# EasyEDA Pro project ProPrj_FYP_Flexible_PCB_Final.epro

# Schematic RC_LPF
Board Name: RC_LPF; Create Date: 2026-05-18; Page Name: P1; Project Name: FYP_Final_ExternalProgrammer; Schematic Name: RC_LPF; Update Date: 2026-05-18; Company: EasyEDA.com; Page Size: A4; Version: V1.0
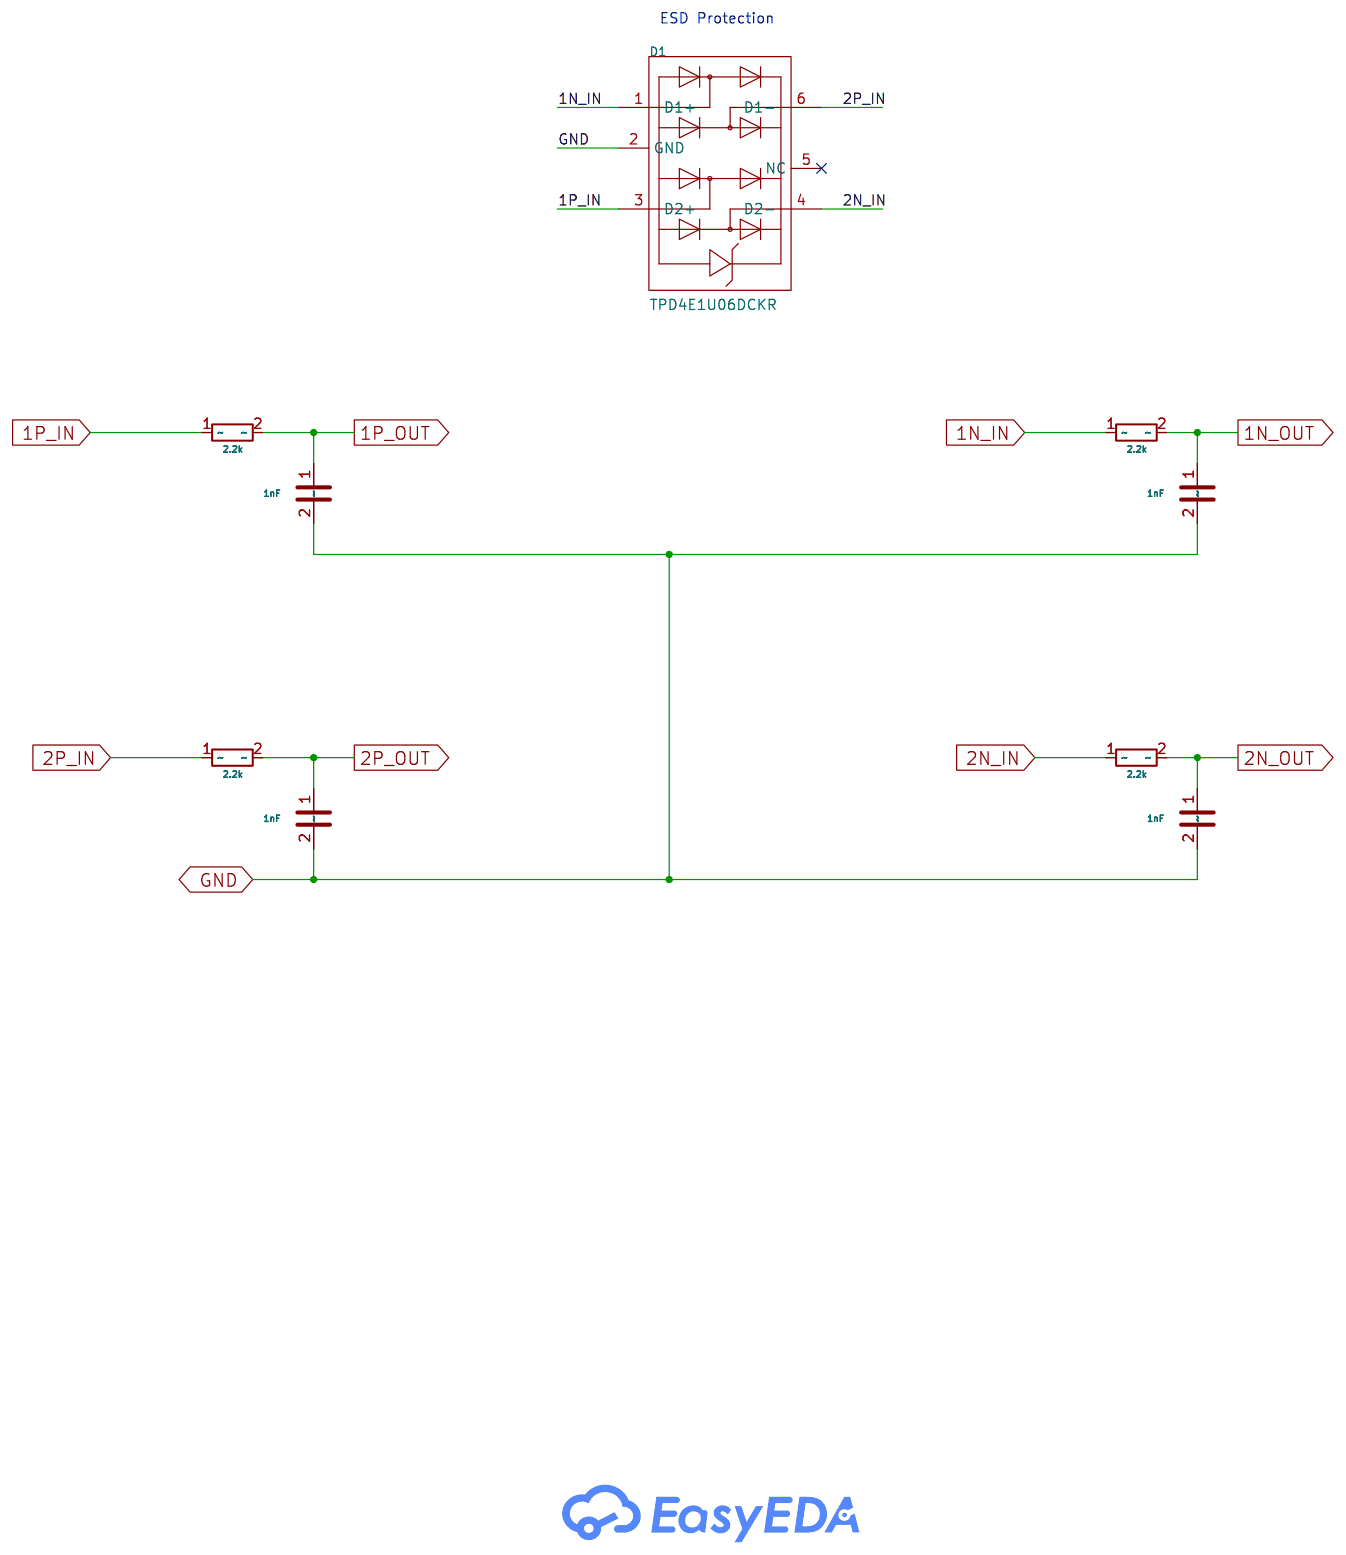
[diagram p0: schematic sheet]

## Parts
C24  1nF  [Capacitor_SMD:C_0805_2012Metric]
C25  1nF  [Capacitor_SMD:C_0805_2012Metric]
C26  1nF  [Capacitor_SMD:C_0805_2012Metric]
C27  1nF  [Capacitor_SMD:C_0805_2012Metric]
D1  TPD4E1U06DCKR  [SC-70-6_L2.2-W1.3-P0.65-LS2.1-BL]
R27  2.2k  [R0402]
R34  2.2k  [R0402]
R35  2.2k  [R0402]
R36  2.2k  [R0402]

## Library data of the parts
C24-C27 = Device_C: Attribute1: C3
D1 = TPD4E1U06DCKR: Polarity:Unidirectional Reverse Stand-Off Voltage (Vrwm):5.5V Clamping Voltage:15V Peak Pulse Current (Ipp):3A@8/20us Peak Pulse Power Dissipation (Ppp):45W@8/20us Voltage - Breakdown:6.5V Reverse Leakage Current (Ir):10nA Number of Channels:4 Operating T; LCSC Part Name: 单向ESD; Supplier Part: C194628; Manufacturer: TI(德州仪器); Supplier Footprint: SOT-363; JLCPCB Part Class: Extended Part; Datasheet: https://www.ti.com/cn/lit/gpn/tpd4e1u06; Supplier: LCSC; Polarity: Unidirectional; Reverse Stand-Off Voltage (Vrwm): 5.5V; Clamping Voltage: 15V; Peak Pulse Current (Ipp): 3A@8/20us; Peak Pulse Power Dissipation (Ppp): 45W@8/20us; Voltage - Breakdown: 6.5V; Reverse Leakage Current (Ir): 10nA; Number of Channels: 4; Operating Temperature: -40℃~+125℃; level of protection: IEC 61000-4-4；IEC 61000-4-5；IEC 61000-4-2; Type: TVS; Junction Capacitance: 0.8pF
R27 R34-R36 = Device_R: Attribute1: R16

## Nets
GND: C24.2 C25.2 C26.2 C27.2 D1.2(GND)
1N_IN: D1.1(D1+) R34.1
1N_OUT: C25.1 R34.2
1P_IN: D1.3(D2+) R27.1
1P_OUT: C24.1 R27.2
2N_IN: D1.4(D2-) R36.1
2N_OUT: C27.1 R36.2
2P_IN: D1.6(D1-) R35.1
2P_OUT: C26.1 R35.2

Not connected (* = marked no-connect by the designer): D1 5(NC)*

## Notes on the sheet
- ESD Protection

# Schematic Schematic1
Board Name: Board1; Create Date: 2026-05-18; Page Name: Main; Project Name: FYP_Final_ExternalProgrammer; Schematic Name: Schematic1; Update Date: 2026-05-19; Company: EasyEDA.com; Page Size: A4; Version: V1.0
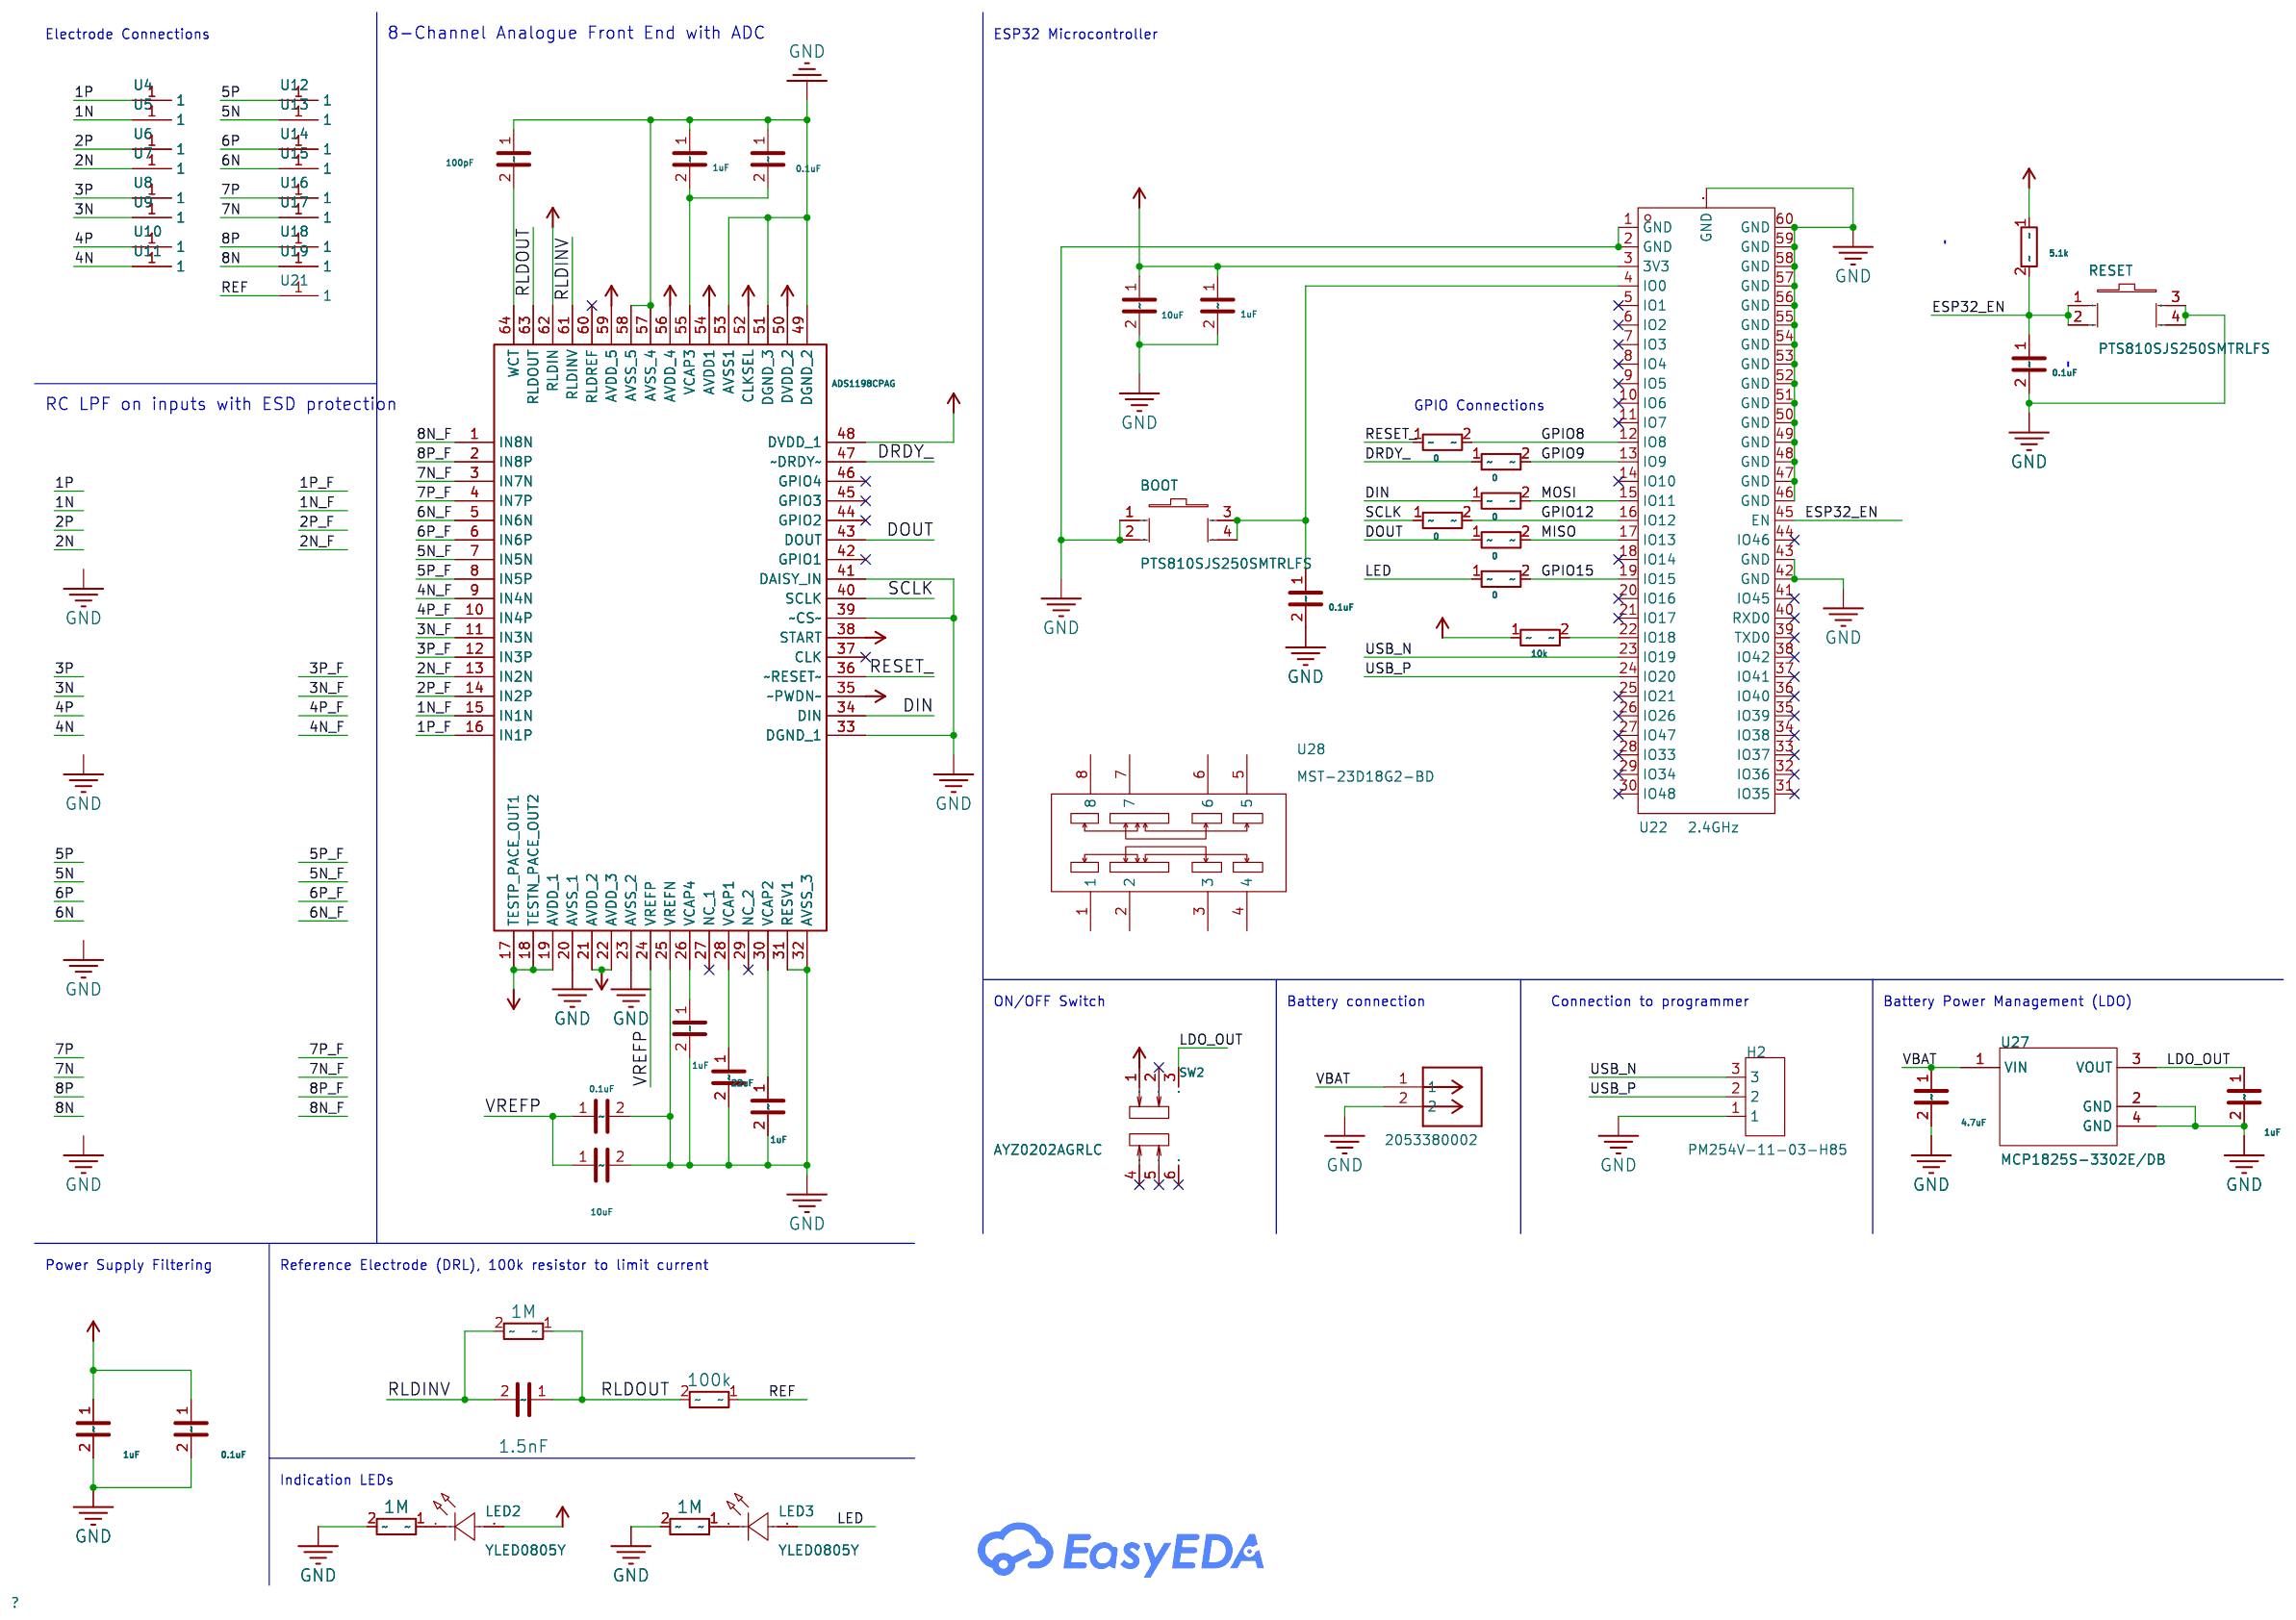
[diagram p1: schematic sheet]

## Parts
BOOT  PTS810SJS250SMTRLFS  [SW-SMD_4P_PTS810SJM250SMTRLFS]
C3  1uF  [Capacitor_SMD:C_0805_2012Metric]
C5  1.5nF  [Capacitor_SMD:C_0805_2012Metric]
C6  100pF  [Capacitor_SMD:C_0805_2012Metric]
C7  0.1uF  [Capacitor_SMD:C_0805_2012Metric]
C8  10uF  [Capacitor_SMD:C_0805_2012Metric]
C9  1uF  [Capacitor_SMD:C_0805_2012Metric]
C10  1uF  [Capacitor_SMD:C_0805_2012Metric]
C11  22uF  [Capacitor_SMD:C_0805_2012Metric]
C12  1uF  [Capacitor_SMD:C_0805_2012Metric]
C18  0.1uF  [Capacitor_SMD:C_0805_2012Metric]
C20  0.1uF  [Capacitor_SMD:C_0805_2012Metric]
C22  0.1uF  [Capacitor_SMD:C_0805_2012Metric]
C23  10uF  [Capacitor_SMD:C_0805_2012Metric]
C28  1uF  [Capacitor_SMD:C_0805_2012Metric]
C29  0.1uF  [Capacitor_SMD:C_0805_2012Metric]
C35  1uF  [Capacitor_SMD:C_0805_2012Metric]
C36  4.7uF  [Capacitor_SMD:C_0805_2012Metric]
CBB1  -
CBB2  -
CBB3  -
CBB4  -
H2  PM254V-11-03-H85  [HDR-TH_3P-P2.54-V-F]
IC2  ADS1198CPAG  [ADS1198CPAG:QFP50P1200X1200X120-64N]
LED2  YLED0805Y  [LED0805-RD_YELLOW]
LED3  YLED0805Y  [LED0805-RD_YELLOW]
R7  1M  [Resistor_SMD:R_0805_2012Metric]
R22  5.1k  [Resistor_SMD:R_0805_2012Metric]
R26  10k  [Resistor_SMD:R_0805_2012Metric]
R27  0  [Resistor_SMD:R_0805_2012Metric]
R29  0  [Resistor_SMD:R_0805_2012Metric]
R30  0  [Resistor_SMD:R_0805_2012Metric]
R31  0  [Resistor_SMD:R_0805_2012Metric]
R32  0  [Resistor_SMD:R_0805_2012Metric]
R33  0  [Resistor_SMD:R_0805_2012Metric]
R37  100k  [Resistor_SMD:R_0805_2012Metric]
R42  1M  [Resistor_SMD:R_0805_2012Metric]
R44  1M  [Resistor_SMD:R_0805_2012Metric]
RESET  PTS810SJS250SMTRLFS  [SW-SMD_4P_PTS810SJM250SMTRLFS]
SW2  AYZ0202AGRLC  [SW-SMD_AYZ0202AGRLC]
U4  -  [Electrode_Contact]  (no BOM)
U5  -  [Electrode_Contact]  (no BOM)
U6  -  [Electrode_Contact]  (no BOM)
U7  -  [Electrode_Contact]  (no BOM)
U8  -  [Electrode_Contact]  (no BOM)
U9  -  [Electrode_Contact]  (no BOM)
U10  -  [Electrode_Contact]  (no BOM)
U11  -  [Electrode_Contact]  (no BOM)
U12  -  [Electrode_Contact]  (no BOM)
U13  -  [Electrode_Contact]  (no BOM)
U14  -  [Electrode_Contact]  (no BOM)
U15  -  [Electrode_Contact]  (no BOM)
U16  -  [Electrode_Contact]  (no BOM)
U17  -  [Electrode_Contact]  (no BOM)
U18  -  [Electrode_Contact]  (no BOM)
U19  -  [Electrode_Contact]  (no BOM)
U20  2053380002  [CONN_2053380000-SD_02_MOL]
U21  -  [Electrode_Contact]  (no BOM)
U22  2.4GHz  [BULETM-SMD_ESP32-S3-MINI-1-N8]
U27  MCP1825S-3302E/DB  [SOT-223-3_L6.5-W3.4-P2.30-LS7.0-BR]
U28  MST-23D18G2-BD  [SW-SMD_SHOU_MST23D18G2]

## Library data of the parts
BOOT RESET = PTS810SJS250SMTRLFS: Circuit:SPST Actuator Style:Round Button Operating Force:6N Mounting Type:Surface Mount,Vertical Length:4.2mm Width:3.2mm Switch Height:2.5mm Contact Current:50mA Voltage Rating:16V With Lamp:- Termination Style:J-Lead Life:- Operating Temperature:-40℃~+8; LCSC Part Name: 轻触开关4.2mm*3.2mm，600gf; Supplier Part: C221897; Manufacturer: C&K; Supplier Footprint: SMD-4P,3.2x4.2mm; JLCPCB Part Class: Extended Part; Datasheet: https://item.szlcsc.com/datasheet/PTS810SJS250SMTRLFS/222327.html; Supplier: LCSC; Circuit: SPST; Actuator Style: Round Button; Operating Force: 6N; Mounting Type: Surface Mount,Vertical; Length: 4.2mm; Width: 3.2mm; Switch Height: 2.5mm; Contact Current: 50mA; Voltage Rating: 16V; Termination Style: J-Lead; Operating Temperature: -40℃~+85℃
C3 = Device_C
C5-C12 C20 C22 C28 C29 C35 C36 = Device_C: Attribute1: C3
C18 C23 = Device_C: Unpolarized capacitor; Attribute1: C3
H2 = PM254V-11-03-H85: Holes Structure:1x3P Pitch:2.54mm Row Spacing:- Circular Hole / Square Hole:Square Hole Mounting Type:Through Hole Number of Rows:1 Number of Positions:3P Current Rating:3A Holes Direction:Top Insulation Height:8.5mm Contact Material:Brass Contact Plating; LCSC Part Name: 1x3P 间距:2.54mm 直插; Supplier Part: C541850; Manufacturer: XFCN(兴飞); Supplier Footprint: 插件,P=2.54mm; JLCPCB Part Class: Extended Part; Datasheet: https://item.szlcsc.com/datasheet/PM254V-11-03-H85/562471.html; Supplier: LCSC; Holes Structure: 1x3P; Pitch: 2.54mm; Circular Hole / Square Hole: Square Hole; Mounting Type: Through Hole; Number of Rows: 1; Number of Positions: 3P; Current Rating: 3A; Holes Direction: Top; Insulation Height: 8.5mm; Contact Material: Brass; Operating Temperature: -40℃~+105℃
IC2 = ADS1198CPAG_ADS1198CPAG: Low-Noise, 8 Channel, 16 Bit Analog Front End for ECG/EEG Measurements; Datasheet: http://www.ti.com/lit/gpn/ads1198; Height: 1.2; Mouser Part Number: 595-ADS1198CPAG; Mouser Price/Stock: https://www.mouser.co.uk/ProductDetail/Texas-Instruments/ADS1198CPAG?qs=kdXDfQWUdfeQh%252BqZGyXmmw%3D%3D; Manufacturer_Name: Texas Instruments; User doc link: http://www.ti.com/lit/gpn/ads1198
LED2 LED3 = YLED0805Y: Lamp Holder Type:- Illumination Color:Yellow Voltage - Forward(Vf):1.8V~2.4V Voltage - Forward(Vf):1.8V~2.4V Power(Watts):60mW Forward Current:20mA Wavelength - Dominant:584nm~596nm Wavelength - Dominant:584nm~596nm Peak Wavelength:598nm Peak Wavelength:5; LCSC Part Name: 发光管; Supplier Part: C20608785; Manufacturer: YONGYUTAI(永裕泰); Supplier Footprint: 0805; JLCPCB Part Class: Extended Part; Datasheet: https://item.szlcsc.com/datasheet/YLED0805Y/21958292.html; Supplier: LCSC; Illumination Color: Yellow; Voltage - Forward(Vf): 1.8V~2.4V; Power(Watts): 60mW; Forward Current: 20mA; Wavelength - Dominant: 584nm~596nm; Peak Wavelength: 598nm; Diode Configuration: Discrete Diode; Lens Color: Water Clear; Luminous Intensity: 210mcd; Viewing Angle: 120°; Operating Temperature: -40℃~+85℃
R7 R22 R26 R27 R29-R33 R37 R42 R44 = Device_R: Attribute1: R16
SW2 = AYZ0202AGRLC: Circuit:DPDT Actuator Style:Rectangular columnar Pin Style:Solder Lug Mounting Style:Brick nogging Voltage Rating (DC):12V Operating Temperature:-10℃~+60℃ Operating Temperature:-10℃~+60℃; LCSC Part Name: 滑动开关 Slide Switch; Supplier Part: C221564; Manufacturer: C&K; Supplier Footprint: SMD; JLCPCB Part Class: Extended Part; Datasheet: https://atta.szlcsc.com/upload/public/pdf/source/20200708/C668526_18EFDDC8015C242D92F888DBF96CBE4C.pdf; Supplier: LCSC; Circuit: DPDT; Actuator Style: Rectangular columnar; Pin Style: Solder Lug; Mounting Style: Brick nogging; Voltage Rating (DC): 12V; Operating Temperature: -10℃~+60℃
U4-U19 U21 = electrode-contact
U20 = 2053380002
U22 = ESP32-S3-MINI-1-N8: Utilized IC / Part:ESP32-S3FN8 Chip Wireless Standard:Bluetooth5.0 Interface Type:SPI；I2S；USB；I2C；UART Frequency:2.4GHz Antenna Type:On-board PCB Antenna Output Power:20.5dBm Output Power:20.5dBm Voltage - Supply:3V~3.6V Voltage - Supply:3V~3.6V Receive; LCSC Part Name: 不带固件 小尺寸模组，集成2.4GHz Wi-Fi(802.11b/g/n)+Bluetooth 5(LE); Supplier Part: C2913206; Manufacturer: ESPRESSIF(乐鑫); Supplier Footprint: SMD; JLCPCB Part Class: Extended Part; Datasheet: https://item.szlcsc.com/datasheet/ESP32-S3-MINI-1-N8/3198304.html; Supplier: LCSC; Utilized IC / Part: ESP32-S3FN8 Chip; Wireless Standard: Bluetooth5.0; Interface Type: SPI；I2S；USB；I2C；UART; Antenna Type: On-board PCB Antenna; Output Power: 20.5dBm; Voltage - Supply: 3V~3.6V; Receive  Current: 97mA; Send  Current: 330mA; Sensitivity: -104.5dBm; Operating Temperature: -40℃~+85℃
U27 = MCP1825S-3302E/DB: Output Type:Fixed Voltage - Supply:6V Output Voltage:3.3V Output Voltage:3.3V Output Current:500mA Power Supply Rejection Ratio (PSRR):60dB@(100Hz) Voltage Dropout:210mV@(500mA) standby current:120uA Features:Short Circuit Protection；Over Temperature Prot; LCSC Part Name: 输入6V 输出3.3V 500mA; Supplier Part: C148031; Manufacturer: MICROCHIP(美国微芯); Supplier Footprint: SOT-223-3; JLCPCB Part Class: Extended Part; Datasheet: https://item.szlcsc.com/datasheet/MCP1825S-3302E%252FDB/159364.html; Supplier: LCSC; Output Type: Fixed; Voltage - Supply: 6V; Output Voltage: 3.3V; Output Current: 500mA; Power Supply Rejection Ratio (PSRR): 60dB@(100Hz); Voltage Dropout: 210mV@(500mA); standby current: 120uA; Features: Short Circuit Protection；Over Temperature Protection；Over Current Protection；Under Voltage Lockout; Operating Temperature: -40℃~+125℃@(Tj); Output Configuration: Positive; Number of Outputs: 1
U28 = MST-23D18G2-BD: Circuit:DP3T Actuator Style:Rectangular Columnar Termination Style:SMD(SMT) Tab Mounting Type:Surface Mount,Vertical Current Rating:100mA Voltage Rating:12V Life:10,000 Cycles Operating Temperature:-10℃~+50℃ Operating Temperature:-10℃~+50℃; LCSC Part Name: MST-23D18G2编带; Supplier Part: C7507443; Manufacturer: SHOU HAN(首韩); Supplier Footprint: SMD; JLCPCB Part Class: Extended Part; Datasheet: https://item.szlcsc.com/datasheet/MST-23D18G2-BD/8598465.html; Supplier: LCSC; Circuit: DP3T; Actuator Style: Rectangular Columnar; Termination Style: SMD(SMT) Tab; Mounting Type: Surface Mount,Vertical; Current Rating: 100mA; Voltage Rating: 12V; Life: 10,000 Cycles; Operating Temperature: -10℃~+50℃

## Nets
GND: BOOT.1 BOOT.2 C3.2 C6.1 C7.2 C8.2 C9.1 C10.2 C11.2 C12.2 C18.1 C20.2 C22.2 C23.2 C28.2 C29.2 C35.2 C36.2 CBB1.5(GND) CBB2.5(GND) CBB3.5(GND) CBB4.5(GND) H2.1 IC2.20(AVSS_1) IC2.23(AVSS_2) IC2.25(VREFN) IC2.31(RESV1) IC2.32(AVSS_3) IC2.33(DGND_1) IC2.39(~CS~) IC2.41(DAISY_IN) IC2.49(DGND_2) IC2.51(DGND_3) IC2.53(AVSS1) IC2.57(AVSS_4) IC2.58(AVSS_5) R42.2 R44.2 RESET.3 RESET.4 U20.2 U22.1(GND) U22.2(GND) U22.42(GND) U22.43(GND) U22.46(GND) U22.47(GND) U22.48(GND) U22.49(GND) U22.50(GND) U22.51(GND) U22.52(GND) U22.53(GND) U22.54(GND) U22.55(GND) U22.56(GND) U22.57(GND) U22.58(GND) U22.59(GND) U22.60(GND) U22.GND U27.2(GND) U27.4(GND)
VBAT: C36.1 U20.1 U27.1(VIN)
1N: CBB1.2(1N_IN) U5.1
1N_F: CBB1.8(1N_OUT) IC2.15(IN1N)
1P: CBB1.1(1P_IN) U4.1
1P_F: CBB1.9(1P_OUT) IC2.16(IN1P)
2N: CBB1.4(2N_IN) U7.1
2N_F: CBB1.6(2N_OUT) IC2.13(IN2N)
2P: CBB1.3(2P_IN) U6.1
2P_F: CBB1.7(2P_OUT) IC2.14(IN2P)
3N: CBB2.2(1N_IN) U9.1
3N_F: CBB2.8(1N_OUT) IC2.11(IN3N)
3P: CBB2.1(1P_IN) U8.1
3P_F: CBB2.9(1P_OUT) IC2.12(IN3P)
4N: CBB2.4(2N_IN) U11.1
4N_F: CBB2.6(2N_OUT) IC2.9(IN4N)
4P: CBB2.3(2P_IN) U10.1
4P_F: CBB2.7(2P_OUT) IC2.10(IN4P)
5N: CBB3.2(1N_IN) U13.1
5N_F: CBB3.8(1N_OUT) IC2.7(IN5N)
5P: CBB3.1(1P_IN) U12.1
5P_F: CBB3.9(1P_OUT) IC2.8(IN5P)
6N: CBB3.4(2N_IN) U15.1
6N_F: CBB3.6(2N_OUT) IC2.5(IN6N)
6P: CBB3.3(2P_IN) U14.1
6P_F: CBB3.7(2P_OUT) IC2.6(IN6P)
7N: CBB4.2(1N_IN) U17.1
7N_F: CBB4.8(1N_OUT) IC2.3(IN7N)
7P: CBB4.1(1P_IN) U16.1
7P_F: CBB4.9(1P_OUT) IC2.4(IN7P)
8N: CBB4.4(2N_IN) U19.1
8N_F: CBB4.6(2N_OUT) IC2.1(IN8N)
8P: CBB4.3(2P_IN) U18.1
8P_F: CBB4.7(2P_OUT) IC2.2(IN8P)
DIN: IC2.34(DIN) R29.1
DOUT: IC2.43(DOUT) R31.1
DRDY_: IC2.47(~DRDY~) R27.1
ESP32_EN: C20.1 R22.2 RESET.1 RESET.2 U22.45(EN)
GPIO8: R33.2 U22.12(IO8)
GPIO9: R27.2 U22.13(IO9)
GPIO12: R30.2 U22.16(IO12)
GPIO15: R32.2 U22.19(IO15)
LDO_OUT: C35.1 SW2.3 U27.3(VOUT)
LED: LED3.2(A) R32.1
MISO: R31.2 U22.17(IO13)
MOSI: R29.2 U22.15(IO11)
POWER_+3.3V: C3.1 C23.1 C28.1 C29.1 IC2.17(TESTP_PACE_OUT1) IC2.18(TESTN_PACE_OUT2) IC2.19(AVDD_1) IC2.21(AVDD_2) IC2.22(AVDD_3) IC2.35(~PWDN~) IC2.38(START) IC2.48(DVDD_1) IC2.50(DVDD_2) IC2.52(CLKSEL) IC2.54(AVDD1) IC2.56(AVDD_4) IC2.59(AVDD_5) IC2.62(RLDIN) LED2.2(A) R22.1 R26.1 SW2.1 U22.3(3V3)
REF: R37.1 U21.1
RESET_: IC2.36(~RESET~) R33.1
RLDINV: C5.2 IC2.61(RLDINV) R7.2
RLDOUT: C5.1 IC2.63(RLDOUT) R7.1 R37.2
SCLK: IC2.40(SCLK) R30.1
USB_N: H2.3 U22.23(IO19)
USB_P: H2.2 U22.24(IO20)
VREFP: C7.1 C8.1 IC2.24(VREFP)
$1N2733: C12.1 IC2.30(VCAP2)
$1N2742: C11.1 IC2.28(VCAP1)
$1N2744: C9.2 C18.2 IC2.55(VCAP3)
$1N2800: C6.2 IC2.64(WCT)
$1N2847: C10.1 IC2.26(VCAP4)
$1N15781: BOOT.3 BOOT.4 C22.1 U22.4(IO0)
$1N16915: R26.2 U22.22(IO18)
$1N37471: LED3.1(K) R42.1
$1N37498: LED2.1(K) R44.1

Not connected (* = marked no-connect by the designer): IC2 27(NC_1)* 29(NC_2)* 37(CLK)* 42(GPIO1)* 44(GPIO2)* 45(GPIO3)* 46(GPIO4)* 60(RLDREF)*; SW2 2* 4* 5* 6*; U22 5(IO1)* 6(IO2)* 7(IO3)* 8(IO4)* 9(IO5)* 10(IO6)* 11(IO7)* 14(IO10)* 18(IO14)* 20(IO16)* 21(IO17)* 25(IO21)* 26(IO26)* 27(IO47)* 28(IO33)* 29(IO34)* 30(IO48)* 31(IO35)* 32(IO36)* 33(IO37)* 34(IO38)* 35(IO39)* 36(IO40)* 37(IO41)* 38(IO42)* 39(TXD0)* 40(RXD0)* 41(IO45)* 44(IO46)*; U28 1 2 3 4 5 6 7 8

## Notes on the sheet
- Electrode Connections
- 8-Channel Analogue Front End with ADC
- ESP32 Microcontroller
- RC LPF on inputs with ESD protection
- GPIO Connections
- ON/OFF Switch
- Battery connection
- Connection to programmer
- Battery Power Management (LDO)
- Power Supply Filtering
- Reference Electrode (DRL), 100k resistor to limit current
- Indication LEDs

# Board PCB1
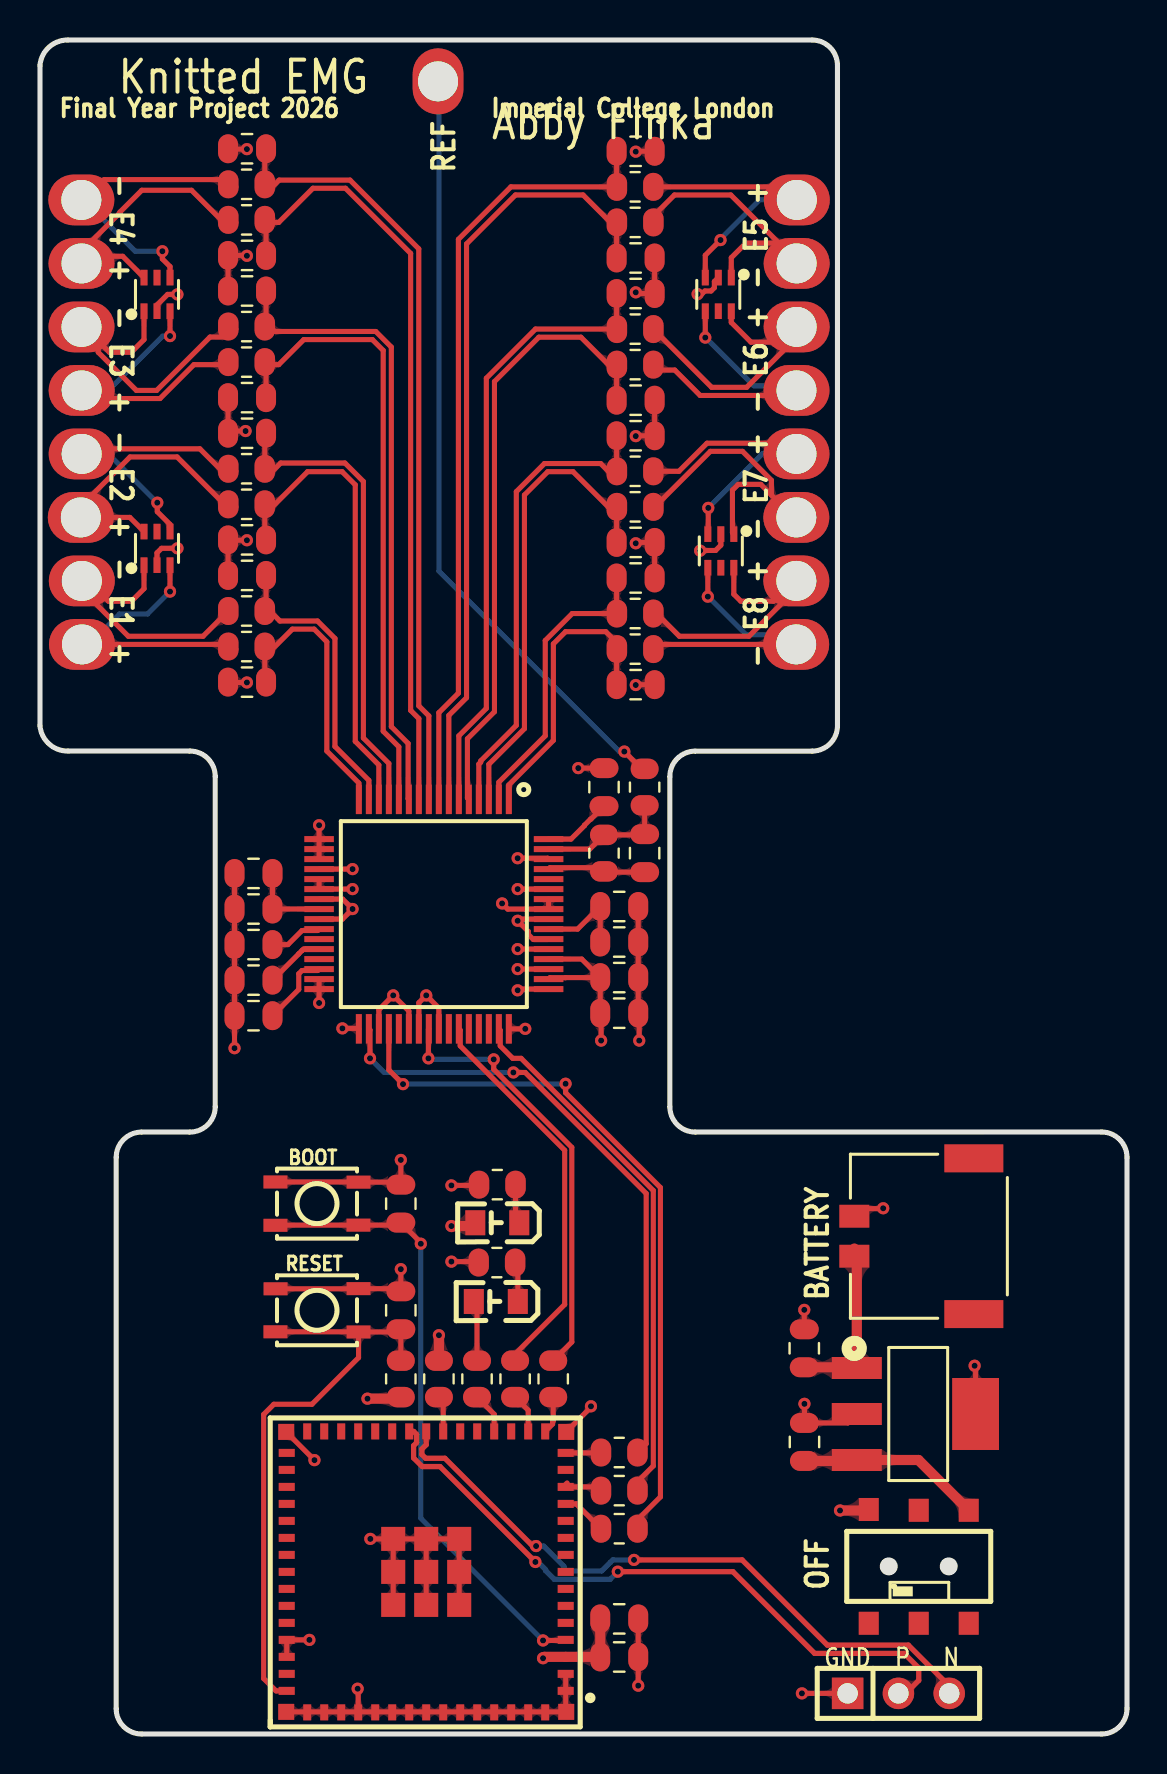
[diagram p2: board, top side]
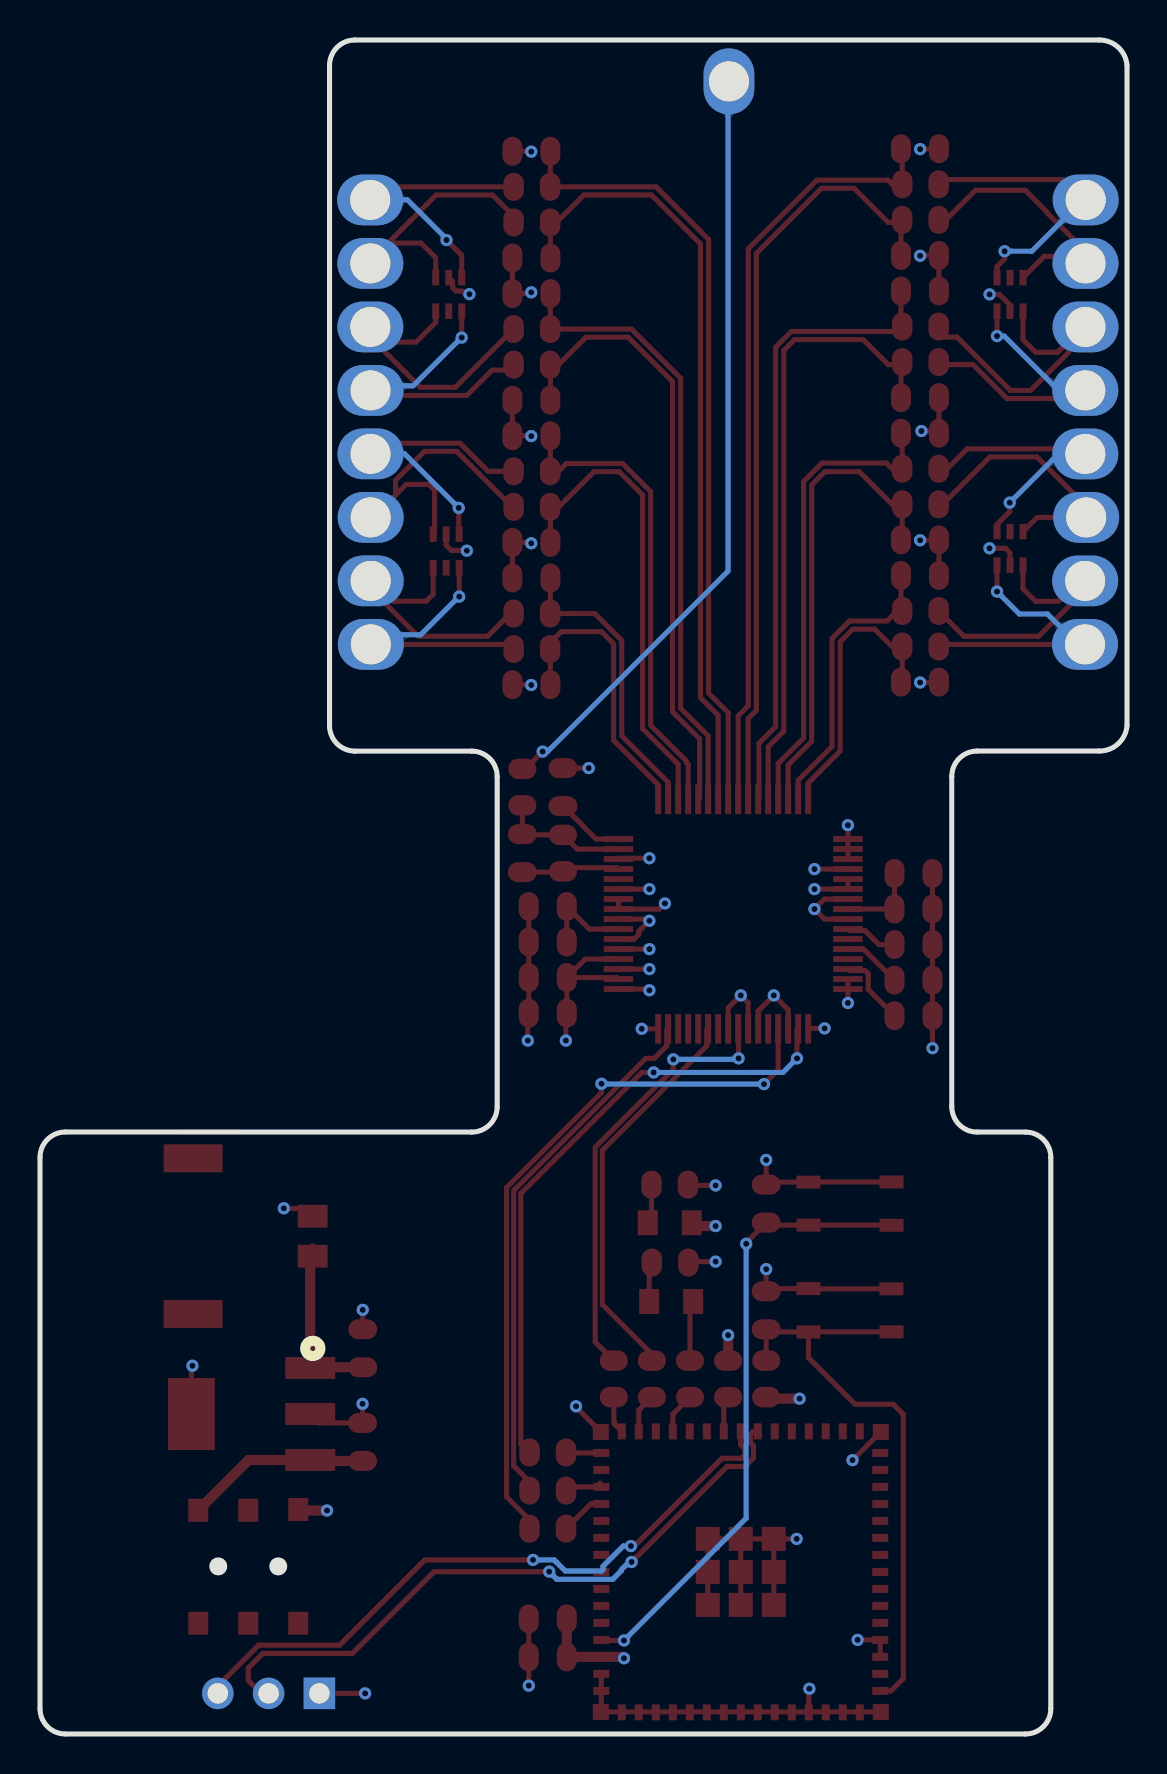
[diagram p3: board, bottom side, seen from below]

Outline 54.36 x 84.71 mm; copper layers: Top Layer, Inner1, Inner2, Bottom Layer. Coordinates in mm from the lower left corner of the outline.
Outline path: 0,83.44 arc(0.45,84.35) 1.4,84.71 38.61,84.71 arc(39.51,84.34) 39.88,83.44 39.88,50.42 arc(39.51,49.52) 38.61,49.15 32.77,49.15 arc(31.87,48.78) 31.5,47.88 31.5,31.37 arc(31.87,30.47) 32.77,30.1 53.09,30.1 arc(53.98,29.73) 54.36,28.83 54.36,1.27 arc(53.98,0.37) 53.09,0 5.08,0 arc(4.18,0.37) 3.81,1.27 3.81,28.83 arc(4.18,29.73) 5.08,30.1 7.49,30.1 arc(8.39,30.47) 8.76,31.37 8.76,47.88 arc(8.39,48.78) 7.49,49.15 1.4,49.15 arc(0.45,49.51) 0,50.42 0,83.44
Stack: Top Layer 0.012mm / Dielectric1 0.025mm FR4 er 4.5 / Inner1 0.035mm / Dielectric4 0.48mm PP er 4.5 / Inner2 0.035mm / Dielectric5 0.48mm PP er 4.5 / Bottom Layer 0.012mm

## Design rules (mm)
net 3P_F: DP3
net 3N_F: DP3
net 4P_F: DP4
net 4N_F: DP4
net 5P_F: DP5
net 5N_F: DP5
net 6P_F: DP6
net 6N_F: DP6
net 7P_F: DP7
net 7N_F: DP7
net 1P_F: DP1
net 1N_F: DP1
net 2P_F: DP2
net 2N_F: DP2
net 8P_F: DP8
net 8N_F: DP8
net 1P: 1
net 2P: 2
net 2N: 2
net 1N: 1
net 3P: 3
net 4P: 4
net 4N: 4
net 3N: 3
net 5P: 5
net 6P: 6
net 6N: 6
net 5N: 5
net 7P: 7
net 8P: 8
net 8N: 8
net 7N: 7
net USB_N: USB_
net USB_P: USB_
template: Custom Config
spacing copperThickness1oz (default): track to track 0.102, other pairs 0.152 to 0.3
spacing copperThickness2oz: track to track 0.203, other pairs 0.152 to 0.3
spacing copperThicknessInner0.5oz: track to track 0.089, other pairs 0.152 to 0.3
track width copperThickness1oz (default): min 0.102, default 0.254, max 2.54
track width copperThickness2oz: min 0.203, default 0.254, max 2.54
track width copperThickness0.5oz: min 0.089, default 0.254, max 2.54
differential pair differentialPair (default): width min 0.127, default 0.254, max 2.54; gap min 0.152, default 0.152
differential pair USB: width min 0.261, default 0.261, max 0.261; gap min 0.152, default 0.152
via viaSize (default): diameter min 0.3, default 0.61, max 10; hole min 0.2, default 0.305, max 6.3
diff pair USB_ uses USB

## Placement (name value [footprint] x y rotation side)
BOOT  PTS810SJS250SMTRLFS  [SW-SMD_4P_PTS810SJM250SMTRLFS]  13.85 26.52 0 top
C1  -  [Capacitor_SMD:C_0805_2012Metric]  10.35 66.82 180 top
C2  -  [Capacitor_SMD:C_0805_2012Metric]  10.35 72.16 180 top
C3  1uF  [Capacitor_SMD:C_0805_2012Metric]  28.97 3.85 0 top
C4  -  [Capacitor_SMD:C_0805_2012Metric]  10.35 73.94 180 top
C5  1.5nF  [Capacitor_SMD:C_0805_2012Metric]  30.24 44.05 270 top
C6  100pF  [Capacitor_SMD:C_0805_2012Metric]  28.2 47.35 270 top
C7  0.1uF  [Capacitor_SMD:C_0805_2012Metric]  10.68 43.03 180 top
C8  10uF  [Capacitor_SMD:C_0805_2012Metric]  10.68 41.25 180 top
C9  1uF  [Capacitor_SMD:C_0805_2012Metric]  28.97 41.38 180 top
C10  1uF  [Capacitor_SMD:C_0805_2012Metric]  10.68 39.48 180 top
C11  22uF  [Capacitor_SMD:C_0805_2012Metric]  10.68 37.7 180 top
C12  1uF  [Capacitor_SMD:C_0805_2012Metric]  10.68 35.92 180 top
C13  -  [Capacitor_SMD:C_0805_2012Metric]  10.35 79.27 180 top
C14  -  [Capacitor_SMD:C_0805_2012Metric]  29.78 79.14 0 top
C15  -  [Capacitor_SMD:C_0805_2012Metric]  29.78 73.81 0 top
C16  -  [Capacitor_SMD:C_0805_2012Metric]  29.78 72.03 0 top
C17  -  [Capacitor_SMD:C_0805_2012Metric]  29.78 66.7 0 top
C18  0.1uF  [Capacitor_SMD:C_0805_2012Metric]  28.97 39.6 180 top
C19  -  [Capacitor_SMD:C_0805_2012Metric]  29.78 64.92 0 top
C20  0.1uF  [Capacitor_SMD:C_0805_2012Metric]  18.04 21.19 90 top
C21  -  [Capacitor_SMD:C_0805_2012Metric]  29.78 59.59 0 top
C22  0.1uF  [Capacitor_SMD:C_0805_2012Metric]  18.04 26.52 90 top
C23  10uF  [Capacitor_SMD:C_0805_2012Metric]  28.97 5.76 0 top
C24  -  [Capacitor_SMD:C_0805_2012Metric]  10.35 52.6 180 top
C25  -  [Capacitor_SMD:C_0805_2012Metric]  10.35 57.93 180 top
C26  -  [Capacitor_SMD:C_0805_2012Metric]  10.35 59.71 180 top
C27  -  [Capacitor_SMD:C_0805_2012Metric]  10.35 65.05 180 top
C28  1uF  [Capacitor_SMD:C_0805_2012Metric]  28.97 37.82 0 top
C29  0.1uF  [Capacitor_SMD:C_0805_2012Metric]  28.97 36.05 0 top
C31  -  [Capacitor_SMD:C_0805_2012Metric]  29.78 57.81 0 top
C32  -  [Capacitor_SMD:C_0805_2012Metric]  29.78 52.47 0 top
C35  1uF  [Capacitor_SMD:C_0805_2012Metric]  38.23 14.6 90 top
C36  4.7uF  [Capacitor_SMD:C_0805_2012Metric]  38.22 19.29 90 top
D1  TPD4E1U06DCKR  [SC-70-6_L2.2-W1.3-P0.65-LS2.1-BL]  5.85 59.29 0 top
D2  TPD4E1U06DCKR  [SC-70-6_L2.2-W1.3-P0.65-LS2.1-BL]  5.85 71.99 0 top
D4  TPD4E1U06DCKR  [SC-70-6_L2.2-W1.3-P0.65-LS2.1-BL]  33.92 71.99 180 top
D5  TPD4E1U06DCKR  [SC-70-6_L2.2-W1.3-P0.65-LS2.1-BL]  34.05 59.16 180 top
H2  PM254V-11-03-H85  [HDR-TH_3P-P2.54-V-F]  42.93 2.03 0 top
IC2  ADS1198CPAG  [ADS1198CPAG:QFP50P1200X1200X120-64N]  19.69 41 270 top
LED2  YLED0805Y  [LED0805-RD_YELLOW]  22.87 25.56 180 top
LED3  YLED0805Y  [LED0805-RD_YELLOW]  22.79 21.63 180 top
R1  -  [Resistor_SMD:R_0805_2012Metric]  10.33 54.38 0 top
R2  -  [Resistor_SMD:R_0805_2012Metric]  10.33 68.6 0 top
R3  -  [Resistor_SMD:R_0805_2012Metric]  10.33 70.38 0 top
R4  -  [Resistor_SMD:R_0805_2012Metric]  10.33 75.71 0 top
R5  -  [Resistor_SMD:R_0805_2012Metric]  10.33 77.49 0 top
R6  -  [Resistor_SMD:R_0805_2012Metric]  29.76 77.37 180 top
R7  1M  [Resistor_SMD:R_0805_2012Metric]  28.2 44.05 270 top
R8  -  [Resistor_SMD:R_0805_2012Metric]  29.76 75.59 180 top
R9  -  [Resistor_SMD:R_0805_2012Metric]  29.76 70.25 180 top
R10  -  [Resistor_SMD:R_0805_2012Metric]  29.76 68.48 180 top
R11  -  [Resistor_SMD:R_0805_2012Metric]  29.76 63.14 180 top
R12  -  [Resistor_SMD:R_0805_2012Metric]  29.76 61.36 180 top
R13  -  [Resistor_SMD:R_0805_2012Metric]  29.76 56.03 180 top
R14  -  [Resistor_SMD:R_0805_2012Metric]  29.76 54.25 180 top
R22  5.1k  [Resistor_SMD:R_0805_2012Metric]  18.04 17.76 90 top
R26  10k  [Resistor_SMD:R_0805_2012Metric]  19.95 17.76 270 top
R27  0  [Resistor_SMD:R_0805_2012Metric]  28.97 12.17 180 top
R29  0  [Resistor_SMD:R_0805_2012Metric]  28.97 14.08 180 top
R30  0  [Resistor_SMD:R_0805_2012Metric]  25.66 17.76 270 top
R31  0  [Resistor_SMD:R_0805_2012Metric]  23.76 17.76 270 top
R32  0  [Resistor_SMD:R_0805_2012Metric]  21.85 17.76 270 top
R33  0  [Resistor_SMD:R_0805_2012Metric]  28.97 10.27 180 top
R34  -  [Resistor_SMD:R_0805_2012Metric]  10.33 56.16 0 top
R35  -  [Resistor_SMD:R_0805_2012Metric]  10.33 61.49 0 top
R36  -  [Resistor_SMD:R_0805_2012Metric]  10.33 63.27 0 top
R37  100k  [Resistor_SMD:R_0805_2012Metric]  30.24 47.35 270 top
R42  1M  [Resistor_SMD:R_0805_2012Metric]  22.85 23.58 180 top
R44  1M  [Resistor_SMD:R_0805_2012Metric]  22.87 27.47 180 top
RESET  PTS810SJS250SMTRLFS  [SW-SMD_4P_PTS810SJM250SMTRLFS]  13.85 21.19 180 top
SW2  AYZ0202AGRLC  [SW-SMD_AYZ0202AGRLC]  43.94 8.38 0 top
U4  -  [Electrode_Contact]  2.1 54.49 270 top
U5  -  [Electrode_Contact]  2.09 57.66 270 top
U6  -  [Electrode_Contact]  2.04 60.84 270 top
U7  -  [Electrode_Contact]  2.08 64.01 270 top
U8  -  [Electrode_Contact]  2.08 67.19 270 top
U9  -  [Electrode_Contact]  2.08 70.36 270 top
U10  -  [Electrode_Contact]  2.08 73.54 270 top
U11  -  [Electrode_Contact]  2.07 76.71 270 top
U12  -  [Electrode_Contact]  37.84 76.71 90 top
U13  -  [Electrode_Contact]  37.84 73.54 90 top
U14  -  [Electrode_Contact]  37.84 70.36 90 top
U15  -  [Electrode_Contact]  37.83 67.19 90 top
U16  -  [Electrode_Contact]  37.83 64.01 90 top
U17  -  [Electrode_Contact]  37.82 60.84 90 top
U18  -  [Electrode_Contact]  37.82 57.66 90 top
U19  -  [Electrode_Contact]  37.81 54.49 90 top
U20  2053380002  [CONN_2053380000-SD_02_MOL]  44.45 24.89 270 top
U21  -  [Electrode_Contact]  19.91 82.64 180 top
U22  2.4GHz  [BULETM-SMD_ESP32-S3-MINI-1-N8]  19.31 8.11 180 top
U27  MCP1825S-3302E/DB  [SOT-223-3_L6.5-W3.4-P2.30-LS7.0-BR]  43.81 16 180 top

## Footprints (pads in the part's own frame, mm; a bottom-side part is the same pattern mirrored in y, then rotated)
ADS1198CPAG:QFP50P1200X1200X120-64N
  rect 1.475x0.3 smd: 1(-5.738,3.75) 2(-5.738,3.25) 3(-5.738,2.75) 4(-5.738,2.25) 5(-5.738,1.75) 6(-5.738,1.25) 7(-5.738,0.75) 8(-5.738,0.25) 9(-5.738,-0.25) 10(-5.738,-0.75) 11(-5.738,-1.25) 12(-5.738,-1.75) 13(-5.738,-2.25) 14(-5.738,-2.75) 15(-5.738,-3.25) 16(-5.738,-3.75) 33(5.738,-3.75) 34(5.738,-3.25) 35(5.738,-2.75) 36(5.738,-2.25) 37(5.738,-1.75) 38(5.738,-1.25) 39(5.738,-0.75) 40(5.738,-0.25) 41(5.738,0.25) 42(5.738,0.75) 43(5.738,1.25) 44(5.738,1.75) 45(5.738,2.25) 46(5.738,2.75) 47(5.738,3.25) 48(5.738,3.75)
  rect 0.3x1.475 smd: 17(-3.75,-5.738) 18(-3.25,-5.738) 19(-2.75,-5.738) 20(-2.25,-5.738) 21(-1.75,-5.738) 22(-1.25,-5.738) 23(-0.75,-5.738) 24(-0.25,-5.738) 25(0.25,-5.738) 26(0.75,-5.738) 27(1.25,-5.738) 28(1.75,-5.738) 29(2.25,-5.738) 30(2.75,-5.738) 31(3.25,-5.738) 32(3.75,-5.738) 49(3.75,5.738) 50(3.25,5.738) 51(2.75,5.738) 52(2.25,5.738) 53(1.75,5.738) 54(1.25,5.738) 55(0.75,5.738) 56(0.25,5.738) 57(-0.25,5.738) 58(-0.75,5.738) 59(-1.25,5.738) 60(-1.75,5.738) 61(-2.25,5.738) 62(-2.75,5.738) 63(-3.25,5.738) 64(-3.75,5.738)
BULETM-SMD_ESP32-S3-MINI-1-N8
  rect 0.8x0.4 smd: 1(-6.975,5.95) 2(-6.975,5.1) 3(-6.975,4.25) 4(-6.975,3.4) 5(-6.975,2.55) 6(-6.975,1.7) 7(-6.975,0.85) 8(-6.975,0) 9(-6.975,-0.85) 10(-6.975,-1.7) 11(-6.975,-2.55) 12(-6.975,-3.4) 13(-6.975,-4.25) 14(-6.975,-5.1) 15(-6.975,-5.95) 31(6.975,-5.95) 32(6.975,-5.1) 33(6.975,-4.25) 34(6.975,-3.4) 35(6.975,-2.55) 36(6.975,-1.7) 37(6.975,-0.85) 38(6.975,0) 39(6.975,0.85) 40(6.975,1.7) 41(6.975,2.55) 42(6.975,3.4) 43(6.975,4.25) 44(6.975,5.1) 45(6.975,5.95)
  rect 0.4x0.8 smd: 16(-5.95,-7.025) 17(-5.1,-7.025) 18(-4.25,-7.025) 19(-3.4,-7.025) 20(-2.55,-7.025) 21(-1.7,-7.025) 22(-0.85,-7.025) 23(0,-7.025) 24(0.85,-7.025) 25(1.7,-7.025) 26(2.55,-7.025) 27(3.4,-7.025) 28(4.25,-7.025) 29(5.1,-7.025) 30(5.95,-7.025) 46(5.95,7.025) 47(5.1,7.025) 48(4.25,7.025) 49(3.4,7.025) 50(2.55,7.025) 51(1.7,7.025) 52(0.85,7.025) 53(0,7.025) 54(-0.85,7.025) 55(-1.7,7.025) 56(-2.55,7.025) 57(-3.4,7.025) 58(-4.25,7.025) 59(-5.1,7.025) 60(-5.95,7.025)
  rect 0.8x0.8 smd: GND(-7,7) GND(-7,-7) GND(7,7) GND(7,-7)
  rect 1.2x1.2 smd: GND(-1.65,1.65) GND(-1.65,0) GND(-1.65,-1.65) GND(0,1.65) GND(0,0) GND(0,-1.65) GND(1.65,1.65) GND(1.65,0) GND(1.65,-1.65)
Capacitor_SMD:C_0805_2012Metric
  rrect 1x1.45 smd: 1(-0.95,0) 2(0.95,0)
CONN_2053380000-SD_02_MOL
  rect 1.143x1.498 smd: 1(1,-3.728) 2(-1,-3.728)
  rect 1.397x2.946 smd: 3(-3.895,2.248) 4(3.895,2.248)
Electrode_Contact
  rrect 2.54x3.302 hole 2: 1(0,0)
HDR-TH_3P-P2.54-V-F
  rect 1.575x1.575 hole 1.02: 1(-2.54,0)
  round 1.575 hole 1.02: 2(0,0) 3(2.54,0)
LED0805-RD_YELLOW
  rect 1x1.25 smd: 1(-1.1,0) 2(1.1,0)
Resistor_SMD:R_0805_2012Metric
  rrect 1.025x1.4 smd: 1(-0.912,0) 2(0.912,0)
SC-70-6_L2.2-W1.3-P0.65-LS2.1-BL
  rect 0.35x0.78 smd: 1(-0.65,-0.84) 2(0,-0.84) 3(0.65,-0.84) 4(0.65,0.84) 5(0,0.84) 6(-0.65,0.84)
SOT-223-3_L6.5-W3.4-P2.30-LS7.0-BR
  rect 2.5x1.1 smd: 1(2.97,-2.3) 2(2.97,0) 3(2.97,2.3)
  rect 2.34x3.6 smd: 4(-2.97,0)
SW-SMD_4P_PTS810SJM250SMTRLFS
  rect 1.2x0.65 smd: 1(-2.078,1.083) 2(2.078,1.075) 3(-2.077,-1.083) 4(2.071,-1.075)
SW-SMD_AYZ0202AGRLC
  rect 1x1.15 smd: 1(-2.5,2.845) 2(0,2.805) 3(2.5,2.805) 4(-2.5,-2.845) 5(0,-2.845) 6(2.5,-2.845)

## Nets
GND: BOOT.1 BOOT.2 C1.2 C2.2 C3.2 C4.2 C6.1 C7.2 C8.2 C9.1 C10.2 C11.2 C12.2 C13.2 C14.2 C15.2 C16.2 C17.2 C18.1 C19.2 C20.2 C21.2 C22.2 C23.2 C24.2 C25.2 C26.2 C27.2 C28.2 C29.2 C31.2 C32.2 C35.2 C36.2 D1.2 D2.2 D4.2 D5.2 H2.1 IC2.20 IC2.23 IC2.25 IC2.31 IC2.32 IC2.33 IC2.39 IC2.41 IC2.49 IC2.51 IC2.53 IC2.57 IC2.58 R42.2 R44.2 RESET.3 RESET.4 U20.2 U22.1 U22.2 U22.42 U22.43 U22.46 U22.47 U22.48 U22.49 U22.50 U22.51 U22.52 U22.53 U22.54 U22.55 U22.56 U22.57 U22.58 U22.59 U22.60 U22.GND U27.2 U27.4
VBAT: C36.1 U20.1 U27.1
1N: D1.1 R34.1 U5.1
1N_F: C25.1 IC2.15 R34.2
1P: D1.3 R1.1 U4.1
1P_F: C24.1 IC2.16 R1.2
2N: D1.4 R36.1 U7.1
2N_F: C27.1 IC2.13 R36.2
2P: D1.6 R35.1 U6.1
2P_F: C26.1 IC2.14 R35.2
3N: D2.1 R3.1 U9.1
3N_F: C2.1 IC2.11 R3.2
3P: D2.3 R2.1 U8.1
3P_F: C1.1 IC2.12 R2.2
4N: D2.4 R5.1 U11.1
4N_F: C13.1 IC2.9 R5.2
4P: D2.6 R4.1 U10.1
4P_F: C4.1 IC2.10 R4.2
5N: D4.1 R8.1 U13.1
5N_F: C15.1 IC2.7 R8.2
5P: D4.3 R6.1 U12.1
5P_F: C14.1 IC2.8 R6.2
6N: D4.4 R10.1 U15.1
6N_F: C17.1 IC2.5 R10.2
6P: D4.6 R9.1 U14.1
6P_F: C16.1 IC2.6 R9.2
7N: D5.1 R12.1 U17.1
7N_F: C21.1 IC2.3 R12.2
7P: D5.3 R11.1 U16.1
7P_F: C19.1 IC2.4 R11.2
8N: D5.4 R14.1 U19.1
8N_F: C32.1 IC2.1 R14.2
8P: D5.6 R13.1 U18.1
8P_F: C31.1 IC2.2 R13.2
DIN: IC2.34 R29.1
DOUT: IC2.43 R31.1
DRDY_: IC2.47 R27.1
ESP32_EN: C20.1 R22.2 RESET.1 RESET.2 U22.45
GPIO8: R33.2 U22.12
GPIO9: R27.2 U22.13
GPIO12: R30.2 U22.16
GPIO15: R32.2 U22.19
LDO_OUT: C35.1 SW2.3 U27.3
LED: LED3.2 R32.1
MISO: R31.2 U22.17
MOSI: R29.2 U22.15
POWER_+3.3V: C3.1 C23.1 C28.1 C29.1 IC2.17 IC2.18 IC2.19 IC2.21 IC2.22 IC2.35 IC2.38 IC2.48 IC2.50 IC2.52 IC2.54 IC2.56 IC2.59 IC2.62 LED2.2 R22.1 R26.1 SW2.1 U22.3
REF: R37.1 U21.1
RESET_: IC2.36 R33.1
RLDINV: C5.2 IC2.61 R7.2
RLDOUT: C5.1 IC2.63 R7.1 R37.2
SCLK: IC2.40 R30.1
USB_N: H2.3 U22.23
USB_P: H2.2 U22.24
VREFP: C7.1 C8.1 IC2.24
$1N2733: C12.1 IC2.30
$1N2742: C11.1 IC2.28
$1N2744: C9.2 C18.2 IC2.55
$1N2800: C6.2 IC2.64
$1N2847: C10.1 IC2.26
$1N15781: BOOT.3 BOOT.4 C22.1 U22.4
$1N16915: R26.2 U22.22
$1N37471: LED3.1 R42.1
$1N37498: LED2.1 R44.1

Pads without a net: D1 5; D2 5; D4 5; D5 5; IC2 27 29 37 42 44 45 46 60; SW2 2 4 5 6; U20 3 4; U22 5 6 7 8 9 10 11 14 18 20 21 25 26 27 28 29 30 31 32 33 34 35 36 37 38 39 40 41 44

## Via types
v1: diameter 0.61, hole 0.305, Top Layer to Bottom Layer, 75 vias

## Routing (per net, layer and track width the routed paths; a pad name or vN(x,y) marks a point on that pad's centre or on a via; arc(x,y) is an arc through that point)
GND: length 131.7
  Top Layer w0.254: D4.2 33.72,72.63 33.72,72.32 33.56,72.16 33.25,72.16 33.09,72 v1(32.88,72) ; IC2.58 IC2.57 23.39,41.25 v1(23.11,41.53) ; v1(38.23,16.51) C35.2 40.4,15.56 U27.2 ; C32.2 29.81,52.47 v1(29.79,52.45) ; v1(10.28,65.16) 9.64,65.16 9.4,64.92 9.4,66.7 ; v1(15.88,2.26) 15.91,2.24 15.91,1.11 ; U22.2 26.29,1.13 U22.GND 15.91,1.11 ; IC2.41 19.94,36.3 v1(19.31,36.94) 18.94,36.57 IC2.39 ; U22.43 U22.42 v1(13.47,4.71) ; IC2.25 15.13,40.75 v1(15.63,41.25) 15.13,41.75 IC2.23 ; U22.GND U22.GND 17.66,9.76 ; IC2.51 v1(23.89,38.25) ; 17.66,9.76 v1(16.52,9.76) ; 17.66,9.76 19.31,9.76 ; v1(29.79,59.54) 29.84,59.59 C21.2 C31.2 ; IC2.33 15.92,35.28 v1(15.12,35.28) ; RESET.4 15.92,22.26 RESET.3 17.91,22.27 C20.2 v1(18.04,23.25) ; v1(20.57,23.62) 21.89,23.62 R42.2 ; C23.2 C3.2 v1(29.92,2.42) ; v1(27.55,16.39) 27.55,16.34 U22.GND ; v1(23.89,37.19) 23.95,37.25 IC2.49 ; v1(10.35,73.92) 10.33,73.94 C4.2 C2.2 ; IC2.31 IC2.32 v1(13.96,36.55) ; v1(46.74,18.42) 46.78,18.37 U27.4 ; BOOT.1 15.92,27.6 BOOT.2 17.92,27.6 C22.2 v1(18.04,28.71) ; U22.GND v1(13.73,13.69) ; D1.2 5.85,59.06 6.08,59.29 v1(6.88,59.29) ; C9.1 C18.1 C28.2 C29.2 29.96,36 v1(29.96,34.67) ; 40.72,26.27 42.15,26.27 v1(42.16,26.29) ; 15.91,1.11 U22.49 ; 15.91,1.11 U22.GND ; D2.2 5.85,71.46 6.38,71.99 v1(6.87,71.99) ; C6.1 v1(26.92,48.3) ; IC2.20 v1(15.63,43.25) ; H2.1 v1(38.1,2.03) ; v1(9.73,34.29) C12.2 C11.2 C10.2 C8.2 C7.2 ; U22.GND U22.GND 20.96,9.76 19.31,9.76 ; v1(29.79,72.09) 29.85,72.03 C16.2 C15.2 ; v1(10.35,59.69) 9.51,59.69 9.4,59.59 9.4,57.81 ; D5.2 34.05,59.44 33.78,59.18 33.02,59.18 v1(33.01,59.17) ; C36.2 v1(38.22,21.21) ; v1(20.57,27.43) 21.92,27.43 R44.2 ; 19.31,9.76 U22.GND U22.GND ; C17.2 C19.2 29.81,64.92 v1(29.79,64.9) ; v1(10.35,52.58) 9.51,52.58 9.4,52.47 ; v1(29.79,79.12) 29.81,79.14 C14.2 ; v1(10.35,79.25) 9.51,79.25 9.4,79.14 ; IC2.53 v1(23.89,39.25)
VBAT: length 8.7
  Top Layer w0.508: 40.72,24.27 40.84,24.15 U27.1 40.81,18.34 C36.1
1N: length 14.4
  Top Layer w0.254: D1.1 5.2,57.27 4.57,56.64 3.43,56.64 2.41,57.66 2.22,57.66 2.22,57.41 ; 2.22,57.41 2.22,57.09 4.42,54.89 8.15,54.89 R34.1 ; 2.22,57.41 2.34,57.41 ; 2.22,57.41 2.09,57.41 ; 2.16,57.6 U5.1
1N_F: length 14.2
  Top Layer w0.254: 11.3,57.81 11.3,56.09 11.24,56.03 ; IC2.15 16.44,47.69 14.75,49.38 14.75,54.78 13.88,55.66 12,55.66 11.62,56.03
1P: length 14.6
  Top Layer w0.254: 9.8,54.25 9.56,54.49 U4.1 ; D1.3 v1(6.5,57.13)
  Bottom Layer w0.254: U4.1 2.46,54.49 3.98,56.01 5.38,56.01 v1(6.5,57.13)
1P_F: length 14.1
  Top Layer w0.254: IC2.16 15.94,47.55 14.34,49.15 14.34,54.61 13.71,55.25 12.62,55.25 11.62,54.25 11.62,54.57 ; 11.24,54.25 11.24,52.54 11.3,52.47
2N: length 14.5
  Top Layer w0.254: 9.8,63.14 9.12,63.14 7.99,64.27 2.47,64.27 2.21,64.01 ; v1(5.87,61.57) 5.87,61.12 6.5,60.49 D1.4
  Bottom Layer w0.254: v1(5.87,61.57) 3.43,64.01 2.21,64.01
2N_F: length 23.3
  Top Layer w0.254: 11.62,63.14 12.04,63.55 15.25,63.55 16.17,62.63 16.17,49.8 17.44,48.53 IC2.13 ; 11.3,64.92 11.24,64.86 11.24,63.14
2P: length 14.4
  Top Layer w0.254: 9.8,61.36 9.35,61.36 6.86,63.86 4.5,63.86 2.34,61.7 1.74,61.7 1.13,61.09 1.13,60.84 ; D1.6 4.49,60.84 2.17,60.84
2P_F: length 23.2
  Top Layer w0.254: 11.3,59.59 11.24,59.65 11.24,61.36 ; 11.62,61.36 13.38,63.12 15.11,63.12 15.77,62.46 15.77,49.64 16.94,48.46 IC2.14
3N: length 14.7
  Top Layer w0.254: 9.8,70.25 9.4,69.85 8.5,69.85 5.83,67.19 4.82,67.19 2.91,69.09 2.91,69.65 ; 2.91,69.65 2.2,70.36 ; 2.91,69.65 3.47,69.09 4.56,69.09 5.2,69.73 D2.1
3N_F: length 31.1
  Top Layer w0.254: IC2.11 18.41,46.77 18.41,49.53 17.57,50.37 17.57,69.35 16.79,70.13 11.74,70.13 11.62,70.25 ; 11.24,70.25 11.3,70.32 11.3,72.03
3P: length 14.7
  Top Layer w0.254: 2.21,67.19 2.62,66.78 6,66.78 7.7,68.48 9.42,68.48 ; v1(6.5,69.9) D2.3
  Bottom Layer w0.254: 2.21,67.19 3.42,67.19 6.14,69.9 v1(6.5,69.9)
3P_F: length 31.2
  Top Layer w0.254: IC2.12 17.94,49.36 17.16,50.14 17.16,69.19 16.62,69.73 13.19,69.73 11.94,68.48 11.62,68.48 11.62,68.79 ; 11.3,66.7 11.3,68.41 11.24,68.48
4N: length 14.6
  Top Layer w0.254: v1(6.12,74.15) 6.12,73.76 6.5,73.38 D2.4 ; 9.8,77.37 9.43,77.73 3.21,77.73 2.19,76.71
  Bottom Layer w0.254: v1(6.12,74.15) 4.76,74.15 2.19,76.71
4N_F: length 38.4
  Top Layer w0.254: 11.24,77.37 11.24,79.08 11.3,79.14 ; 11.62,77.37 11.96,77.7 15.5,77.7 18.94,74.27 18.94,51.41 19.44,50.91 IC2.9
4P: length 14.5
  Top Layer w0.254: D2.6 4.14,73.89 2.69,73.89 ; 2.69,73.89 2.33,73.54 1.17,73.54 ; 2.69,73.89 2.56,74.02 2.56,74.63 4,76.07 4,76.1 5.09,77.19 7.58,77.19 9.31,75.46 9.67,75.46 9.8,75.59
4P_F: length 38.6
  Top Layer w0.254: IC2.10 18.94,50.78 18.53,51.19 18.53,74.04 15.27,77.3 13.65,77.3 11.94,75.59 11.62,75.59 11.62,75.91 ; 11.3,73.81 11.3,75.53 11.24,75.59
5N: length 14.2
  Top Layer w0.254: 34.57,72.83 34.57,73.82 35.3,74.55 36.69,74.55 37.71,73.54 ; R8.1 30.67,75.91 31.73,76.96 34.54,76.96 37.71,73.79 37.71,73.54
5N_F: length 39
  Top Layer w0.254: IC2.7 20.44,50.94 21.33,51.82 21.33,74.51 23.78,76.96 27.16,76.96 28.53,75.59 R8.2 28.83,75.58 C15.1
5P: length 14
  Top Layer w0.254: 37.72,76.72 37.07,77.37 R6.1 ; 33.27,72.87 33.27,73.94 v1(34.03,74.71)
  Bottom Layer w0.254: 37.72,76.72 35.98,76.72 33.97,74.71
5P_F: length 39.2
  Top Layer w0.254: C14.1 28.83,77.38 R6.2 23.55,77.37 20.92,74.74 20.92,52.05 19.94,51.07 IC2.8
6N: length 15.1
  Top Layer w0.254: 37.7,67.19 37.44,66.93 33.01,66.93 31.74,68.2 30.49,68.2 30.41,68.28 ; v1(33.27,69.83) 33.27,71.19
  Bottom Layer w0.254: v1(33.27,69.83) 33.28,69.83 35.7,67.42 36.97,67.42 37.45,66.94 37.7,67.19
6N_F: length 30.9
  Top Layer w0.254: C17.1 28.83,68.46 R10.2 28.42,68.48 27.05,69.85 24.95,69.85 22.73,67.63 22.73,51.12 21.37,49.77 21.37,46.81 IC2.5
6P: length 14.8
  Top Layer w0.254: 34.57,71.15 34.57,70.58 35.55,69.6 36.95,69.6 ; 36.95,69.6 37.71,70.36 37.71,69.43 ; 36.95,69.6 37.33,69.6 37.46,69.47 35.33,67.34 33.59,67.34 R9.1
6P_F: length 31
  Top Layer w0.254: C16.1 28.83,70.27 R9.2 24.78,70.25 22.32,67.8 22.32,51.29 20.94,49.91 IC2.6
7N: length 14.4
  Top Layer w0.254: 30.75,61.36 33.52,64.14 35.13,64.14 36.58,62.69 36.58,61.95 ; D5.1 34.63,60.07 34.63,62.2 34.92,62.49 36.04,62.49 36.58,61.95 ; 36.58,61.95 37.69,60.84
7N_F: length 23.6
  Top Layer w0.254: IC2.3 22.44,48.49 24.23,50.27 24.23,61.95 25.39,63.12 26.65,63.12 28.41,61.36 R12.2 28.83,61.35 C21.1
7P: length 14.6
  Top Layer w0.254: D5.3 33.42,60.02 v1(33.42,61.31) ; 37.7,64.02 37.18,64.55 33.35,64.55 31.95,63.14 R11.1
  Bottom Layer w0.254: 37.7,64.02 36.12,64.02 v1(33.42,61.31)
7P_F: length 23.7
  Top Layer w0.254: IC2.4 21.94,48.5 22.04,48.59 22.04,48.66 23.82,50.44 23.82,62.12 25.23,63.53 28.03,63.53 28.42,63.14 R11.2 28.83,63.15 C19.1
8N: length 13.8
  Top Layer w0.254: D5.4 v1(33.4,56.87) ; R14.1 30.91,54.49 37.69,54.49
  Bottom Layer w0.254: 37.69,54.49 37.21,54.97 35.32,54.97 33.41,56.87 v1(33.4,56.87)
8N_F: length 14.5
  Top Layer w0.254: C32.1 28.83,54.24 R14.2 28.85,54.57 28.29,55.12 26.28,55.12 25.67,54.51 25.67,49.69 23.44,47.46 IC2.1
8P: length 13.8
  Top Layer w0.254: D5.6 34.7,57 35.05,56.65 36.68,56.65 37.69,57.66 37.69,57.14 35.45,54.89 31.97,54.89 30.84,56.03 R13.1
8P_F: length 14.3
  Top Layer w0.254: IC2.2 22.94,47.59 25.27,49.92 25.27,54.68 26.62,56.03 28.34,56.03 ; R13.2 28.83,56.04 C31.1
DIN: length 31.2
  Top Layer w0.254: IC2.34 16.5,35.2 v1(16.5,33.79) ; v1(23.67,33.08) 24.26,33.08 30.31,27.03 30.31,14.51 R29.1
  Bottom Layer w0.254: v1(23.67,33.08) 17.21,33.08 v1(16.5,33.79)
DOUT: length 19.8
  Top Layer w0.254: IC2.43 21.02,35.19 21.02,34.41 26.24,29.19 26.24,21.48 23.76,19 R31.1
DRDY_: length 26.9
  Top Layer w0.254: R27.1 29.88,12.62 30.67,13.41 30.67,27.18 24.06,33.79 23.64,33.79 23.02,34.41 23.02,35.19 IC2.47
ESP32_EN: length 29.6
  Top Layer w0.254: RESET.1 15.93,18.82 13.6,16.49 11.69,16.49 11.19,15.98 11.19,2.77 11.8,2.16 12.21,2.16 ; RESET.1 15.92,20.11 RESET.2 ; RESET.1 17.91,20.1 C20.1 R22.2
GPIO8: length 2.3
  Top Layer w0.254: R33.2 26.81,11.51 U22.12
GPIO9: length 2.1
  Top Layer w0.254: 26.36,12.55 26.23,12.42 26.16,12.36 ; R27.2 27.87,12.36 U22.13
GPIO12: length 1.9
  Top Layer w0.254: R30.2 25.66,15.65 25.63,15.62 25.63,15.5 U22.16
GPIO15: length 2.1
  Top Layer w0.254: R32.2 22.71,15.99 U22.19
LDO_OUT: length 9.3
  Top Layer w0.254: 40.8,13.66 U27.3
  Top Layer w0.508: C35.1 40.8,13.66 ; U27.3 43.93,13.7 SW2.3
LED: length 3
  Top Layer w0.254: LED3.2 21.85,21.47 R32.1
MISO: length 2
  Top Layer w0.254: R31.2 24.41,16.19 U22.17
MOSI: length 1.8
  Top Layer w0.254: 26.18,14.08 26.16,14.06 ; U22.15 28.03,14.06 R29.2
POWER_+3.3V: length 34.6
  Top Layer w0.254: IC2.56 23.97,40.75 v1(23.89,40.67) 24.42,40.14 24.42,39.98 24.67,39.73 25.41,39.73 IC2.54 ; IC2.52 27.09,38.75 C28.1 ; v1(15.63,42.25) IC2.22 IC2.21 ; IC2.35 16.94,36.22 v1(17.66,36.94) 18.44,36.15 IC2.38 ; C28.1 26.29,37.82 26.29,37.82 25.5,37.82 IC2.50 ; C28.1 C29.1 28.06,36 v1(28.06,34.67) ; IC2.62 25.39,43.79 v1(23.89,43.79) ; v1(13.96,45.44) IC2.17 IC2.18 IC2.19 ; IC2.48 v1(24.27,35.26) ; IC2.59 v1(23.89,42.25)
  Top Layer w0.508: v1(16.38,16.77) 17.97,16.77 R22.1 ; C23.1 C3.1 28.01,3.86 U22.3 25.22,3.86 v1(25.16,3.79) ; v1(40.01,11.18) 41.39,11.18 SW2.1 ; v1(20.57,25.4) 21.6,25.4 21.77,25.56 ; R26.1 v1(19.95,19.94)
REF: length 38.5
  Top Layer w0.254: v1(29.22,49.13) 30.08,48.26 R37.1
  Bottom Layer w0.254: v1(29.22,49.13) 28.97,49.13 19.95,58.15 19.95,82.22 19.91,82.26
RESET_: length 35.9
  Top Layer w0.254: IC2.36 17.44,33.21 v1(18.15,32.5) ; v1(26.28,32.52) 26.28,32.07 31.03,27.32 31.03,11.86 29.88,10.71 R33.1
  Bottom Layer w0.254: v1(26.28,32.52) 26.26,32.5 v1(18.15,32.5)
RLDINV: length 4.9
  Top Layer w0.254: IC2.61 25.5,43.32 28.02,43.32 R7.2 28.24,43.1 C5.2
RLDOUT: length 6.6
  Top Layer w0.254: R37.2 C5.1 30.2,44.96 R7.1 27.49,44.25 IC2.63
SCLK: length 21.8
  Top Layer w0.254: v1(22.69,33.73) 22.69,33.24 26.59,29.33 26.59,19.6 R30.1 ; v1(19.42,33.79) 19.42,35.24 IC2.40
  Bottom Layer w0.254: v1(19.42,33.79) 19.48,33.73 v1(22.69,33.73)
USB_N: length 33.3
  Top Layer w0.261: v1(29.7,8.71) 35.11,8.71 39.37,4.44 43.42,4.44 45.47,2.4 H2.3 ; v1(24.81,9.4) 24.64,9.4 20.25,13.79 19.28,13.79 19.1,13.98 19.1,14.25 19.31,14.46 U22.23
  Bottom Layer w0.261: v1(24.81,9.4) 25.19,9.4 26.2,8.38 26.2,8.21 26.27,8.15 28.09,8.15 28.52,8.58 28.52,8.58 28.65,8.71 v1(29.7,8.71)
USB_P: length 33.5
  Top Layer w0.261: v1(24.77,8.6) 20,13.37 19.11,13.37 18.68,13.81 18.68,14.42 18.83,14.57 18.83,14.98 18.68,15.13 U22.24 ; v1(28.89,8.12) 34.65,8.12 38.73,4.03 43.21,4.03 43.94,3.3 43.94,2.68 43.3,2.03 H2.2
  Bottom Layer w0.261: v1(28.89,8.12) 28.51,7.74 25.71,7.74 25.28,8.17 25.28,8.22 24.9,8.6 v1(24.77,8.6)
VREFP: length 4.1
  Top Layer w0.254: C7.1 C8.1 13.95,41.25 IC2.24
$1N2733: length 3.8
  Top Layer w0.254: C12.1 12.94,37.23 12.94,38.02 13.1,38.18 13.89,38.18 13.96,38.25
$1N2742: length 3
  Top Layer w0.254: C11.1 12.94,39.01 12.94,39.02 13.1,39.18 13.11,39.18 13.18,39.25 IC2.28
$1N2744: length 4.8
  Top Layer w0.254: IC2.55 26.88,40.25 C9.2 C18.2
$1N2800: length 3.5
  Top Layer w0.254: C6.2 27.56,45.75 27.53,45.75 27.22,45.44 27.22,45.42 26.55,44.75 IC2.64
$1N2847: length 2.6
  Top Layer w0.254: C10.1 12.4,39.48 13.1,40.18 13.89,40.18 IC2.26
$1N15781: length 31.2
  Top Layer w0.254: BOOT.3 11.78,25.45 BOOT.4 17.92,25.45 C22.1 19.04,24.57 v1(19.04,24.52) ; v1(25.16,4.68) 26.13,4.68 26.16,4.71
  Bottom Layer w0.254: v1(25.16,4.68) 19.04,10.79 v1(19.04,24.52)
$1N16915: length 1.8
  Top Layer w0.254: R26.2 20.16,16.63 U22.22
$1N37471: length 2
  Top Layer w0.254: R42.1 23.89,23.44 LED3.1
$1N37498: length 2
  Top Layer w0.254: 23.97,25.56 23.78,25.75 R44.1

## Copper pours and planes (outline as drawn; the poured copper is in the pictures)
GND on Inner1: 0.26,84.45 54.1,84.45 54.1,0.26 0.26,0.26
POWER_+3.3V on Inner2: 0.26,84.45 54.1,84.45 54.1,0.26 0.26,0.26

Small or netless copper shapes (teardrops, artwork), in the pictures only: 445 on Top Layer, 30 on Bottom Layer, 4 on Inner1

## Text on the board
Top Silkscreen Layer: GND | P | N | Final Year Project 2026 | Imperial College London | BATTERY | - E4 + | - E3 + | - E2 + | - E1 + | REF | - E5 + | - E6 + | - E7 + | - E8 + | OFF | Knitted EMG | Abby Finka
